# EAGLE schematic motor_pcb (EAGLE 7.2.0)
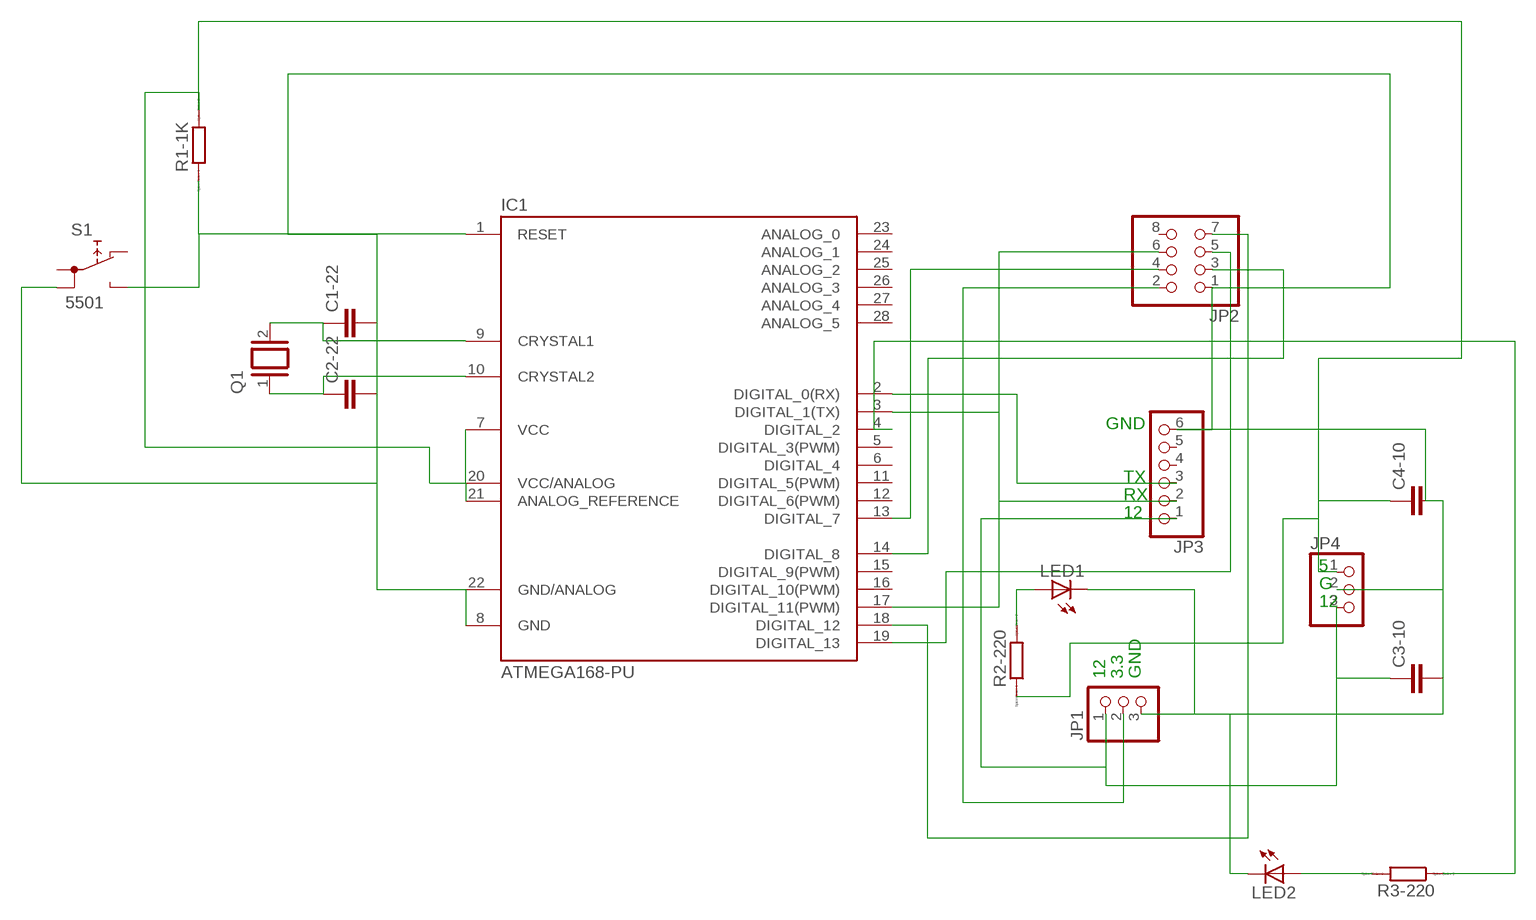
[diagram p0: schematic, sheet 1]

## Parts
C1-22  C2.5/2  [C2.5-2]
C2-22  C2.5/2  [C2.5-2]
C3-10  C2.5/2  [C2.5-2]
C4-10  C2.5/2  [C2.5-2]
IC1  ATMEGA168-PU  [DIL28-3]
JP1  PINHD-1X3  [1X03]
JP2  PINHD-2X4  [2X04]
JP3  PINHD-1X6  [1X06]
JP4  PINHD-1X3  [1X03]
LED1  LED3MM  [LED3MM]
LED2  LED3MM  [LED3MM]
Q1  XTAL/S  [QS]
R1-1K  R0204/7  [0204/7]
R2-220  R0204/7  [0204/7]
R3-220  R0204/7  [0204/7]
S1  5501  [5501]

## Nets
N$1: C1-22.1 IC1.9(CRYSTAL1) Q1.2
N$2: C2-22.1 IC1.10(CRYSTAL2) Q1.1
N$4: C3-10.1 JP1.1 JP4.3
N$5: LED1.A R2-220.2
N$6: JP1.2 JP2.2
N$7: C4-10.1 IC1.7(VCC) IC1.20(VCC/ANALOG) IC1.21(ANALOG_REFERENCE) JP4.1 R1-1K.2
N$8: IC1.2(DIGITAL_0(RX)) JP3.3
N$9: IC1.3(DIGITAL_1(TX)) JP3.2
N$10: IC1.1(RESET) R1-1K.1 S1.NO
N$11: IC1.14(DIGITAL_8) JP2.3
N$12: IC1.13(DIGITAL_7) JP2.4
N$13: IC1.19(DIGITAL_13) JP2.5
N$14: IC1.17(DIGITAL_11(PWM)) JP2.6
N$15: IC1.18(DIGITAL_12) JP2.7
N$16: IC1.4(DIGITAL_2) R3-220.1
N$17: LED2.A R3-220.2
N$18: LED1.K(C)
N$19: C1-22.2 C2-22.2 C3-10.2 C4-10.2 IC1.8(GND) IC1.22(GND/ANALOG) JP1.3 JP2.1 JP3.6 JP4.2 LED2.K(C)
N$20: R2-220.1
N$21: JP3.1
N$22: S1.1B
Unconnected: IC1.5(DIGITAL_3(PWM)) IC1.6(DIGITAL_4) IC1.11(DIGITAL_5(PWM)) IC1.12(DIGITAL_6(PWM)) IC1.15(DIGITAL_9(PWM)) IC1.16(DIGITAL_10(PWM)) IC1.23(ANALOG_0) IC1.24(ANALOG_1) IC1.25(ANALOG_2) IC1.26(ANALOG_3) IC1.27(ANALOG_4) IC1.28(ANALOG_5) JP2.8 JP3.4 JP3.5 S1.1A S1.NC

## Notes on the sheet
- GND
- TX
- RX
- 12
- 5
- G
- 12
- 12 | 3.3 | GND

## Library data of the parts
C1-22 C2-22 C3-10 C4-10 = capacitor-wima:C: CAPACITOR naming: grid - package width
IC1 = Arduino-AVR:ATMEGA168-PU
JP1 JP4 = pinhead:PINHD-1X3: PIN HEADER
JP2 = pinhead:PINHD-2X4: PIN HEADER
JP3 = pinhead:PINHD-1X6: PIN HEADER
LED1 LED2 = led:LED: LED OSRAM: - CHIPLED LG R971, LG N971, LY N971, LG Q971, LY Q971, LO R971, LY R971 LH N974, LH R974 LS Q976, LO Q976, LY Q976 LO Q996 - Hyper CHIPLED LW Q18S LB Q993, LB Q99A, LB R99A - SideLED LS A670, LO A670, LY A670, LG A670, LP A670 LB A673, LV A673, LT A673, LW A673 LH A674 LY A675 LS A676, LA A676, LO A676, LY A676, LW A676 LS A679, LY A679, LG A679 - Hyper Micro SIDELED® LS Y876, LA Y876, LO Y876, LY Y876 LT Y87S - SmartLED LW L88C, LW L88S LB L89C, LB L89S, LG L890 LS L89K, LO L89K, LY L89K LS L896, LA L896, LO L896, LY L896 - TOPLED LS T670, LO T670, LY T670, LG T670, LP T670 LSG T670, LSP T670, LSY T670, LOP T670, LYG T670 LG T671, LOG T671, LSG T671 LB T673, LV T673, LT T673, LW T673 LH T674 LS T676, LA T676, LO T676, LY T676, LB T676, LH T676, LSB T676, LW T676 LB T67C, LV T67C, LT T67C, LS T67K, LO T67K, LY T67K, LW E67C LS E67B, LA E67B, LO E67B, LY E67B, LB E67C, LV E67C, LT E67C LW T67C LS T679, LY T679, LG T679 LS T770, LO T770, LY T770, LG T770, LP T770 LB T773, LV T773, LT T773, LW T773 LH T774 LS E675, LA E675, LY E675, LS T675 LS T776, LA T776, LO T776, LY T776, LB T776 LHGB T686 LT T68C, LB T68C - Hyper Mini TOPLED® LB M676 - Mini TOPLED Santana® LG M470 LS M47K, LO M47K, LY M47K Source: http://www.osram.convergy.de LUXEON: - LUMILED® LXK2-PW12-R00, LXK2-PW12-S00, LXK2-PW14-U00, LXK2-PW14-V00 LXK2-PM12-R00, LXK2-PM12-S00, LXK2-PM14-U00 LXK2-PE12-Q00, LXK2-PE12-R00, LXK2-PE12-S00, LXK2-PE14-T00, LXK2-PE14-U00 LXK2-PB12-K00, LXK2-PB12-L00, LXK2-PB12-M00, LXK2-PB14-N00, LXK2-PB14-P00, LXK2-PB14-Q00 LXK2-PR12-L00, LXK2-PR12-M00, LXK2-PR14-Q00, LXK2-PR14-R00 LXK2-PD12-Q00, LXK2-PD12-R00, LXK2-PD12-S00 LXK2-PH12-R00, LXK2-PH12-S00 LXK2-PL12-P00, LXK2-PL12-Q00, LXK2-PL12-R00 Source: www.luxeon.com KINGBRIGHT: KA-3528ASYC Source: www.kingbright.com
Q1 = special:XTAL/S: CRYSTAL
R1-1K R2-220 R3-220 = eagle-ltspice:R: RESISTOR, European symbol; SPICEMODEL: NONE; SPICEPREFIX: R
S1 = switch:55?: PUSHBUTTON SERIES 5500 SWITCHES Source: www.e-switch.com .. 5500.pdf